# EAGLE schematic Solar_Tracker (EAGLE 7.5.0)

## Sheet 1 of 2
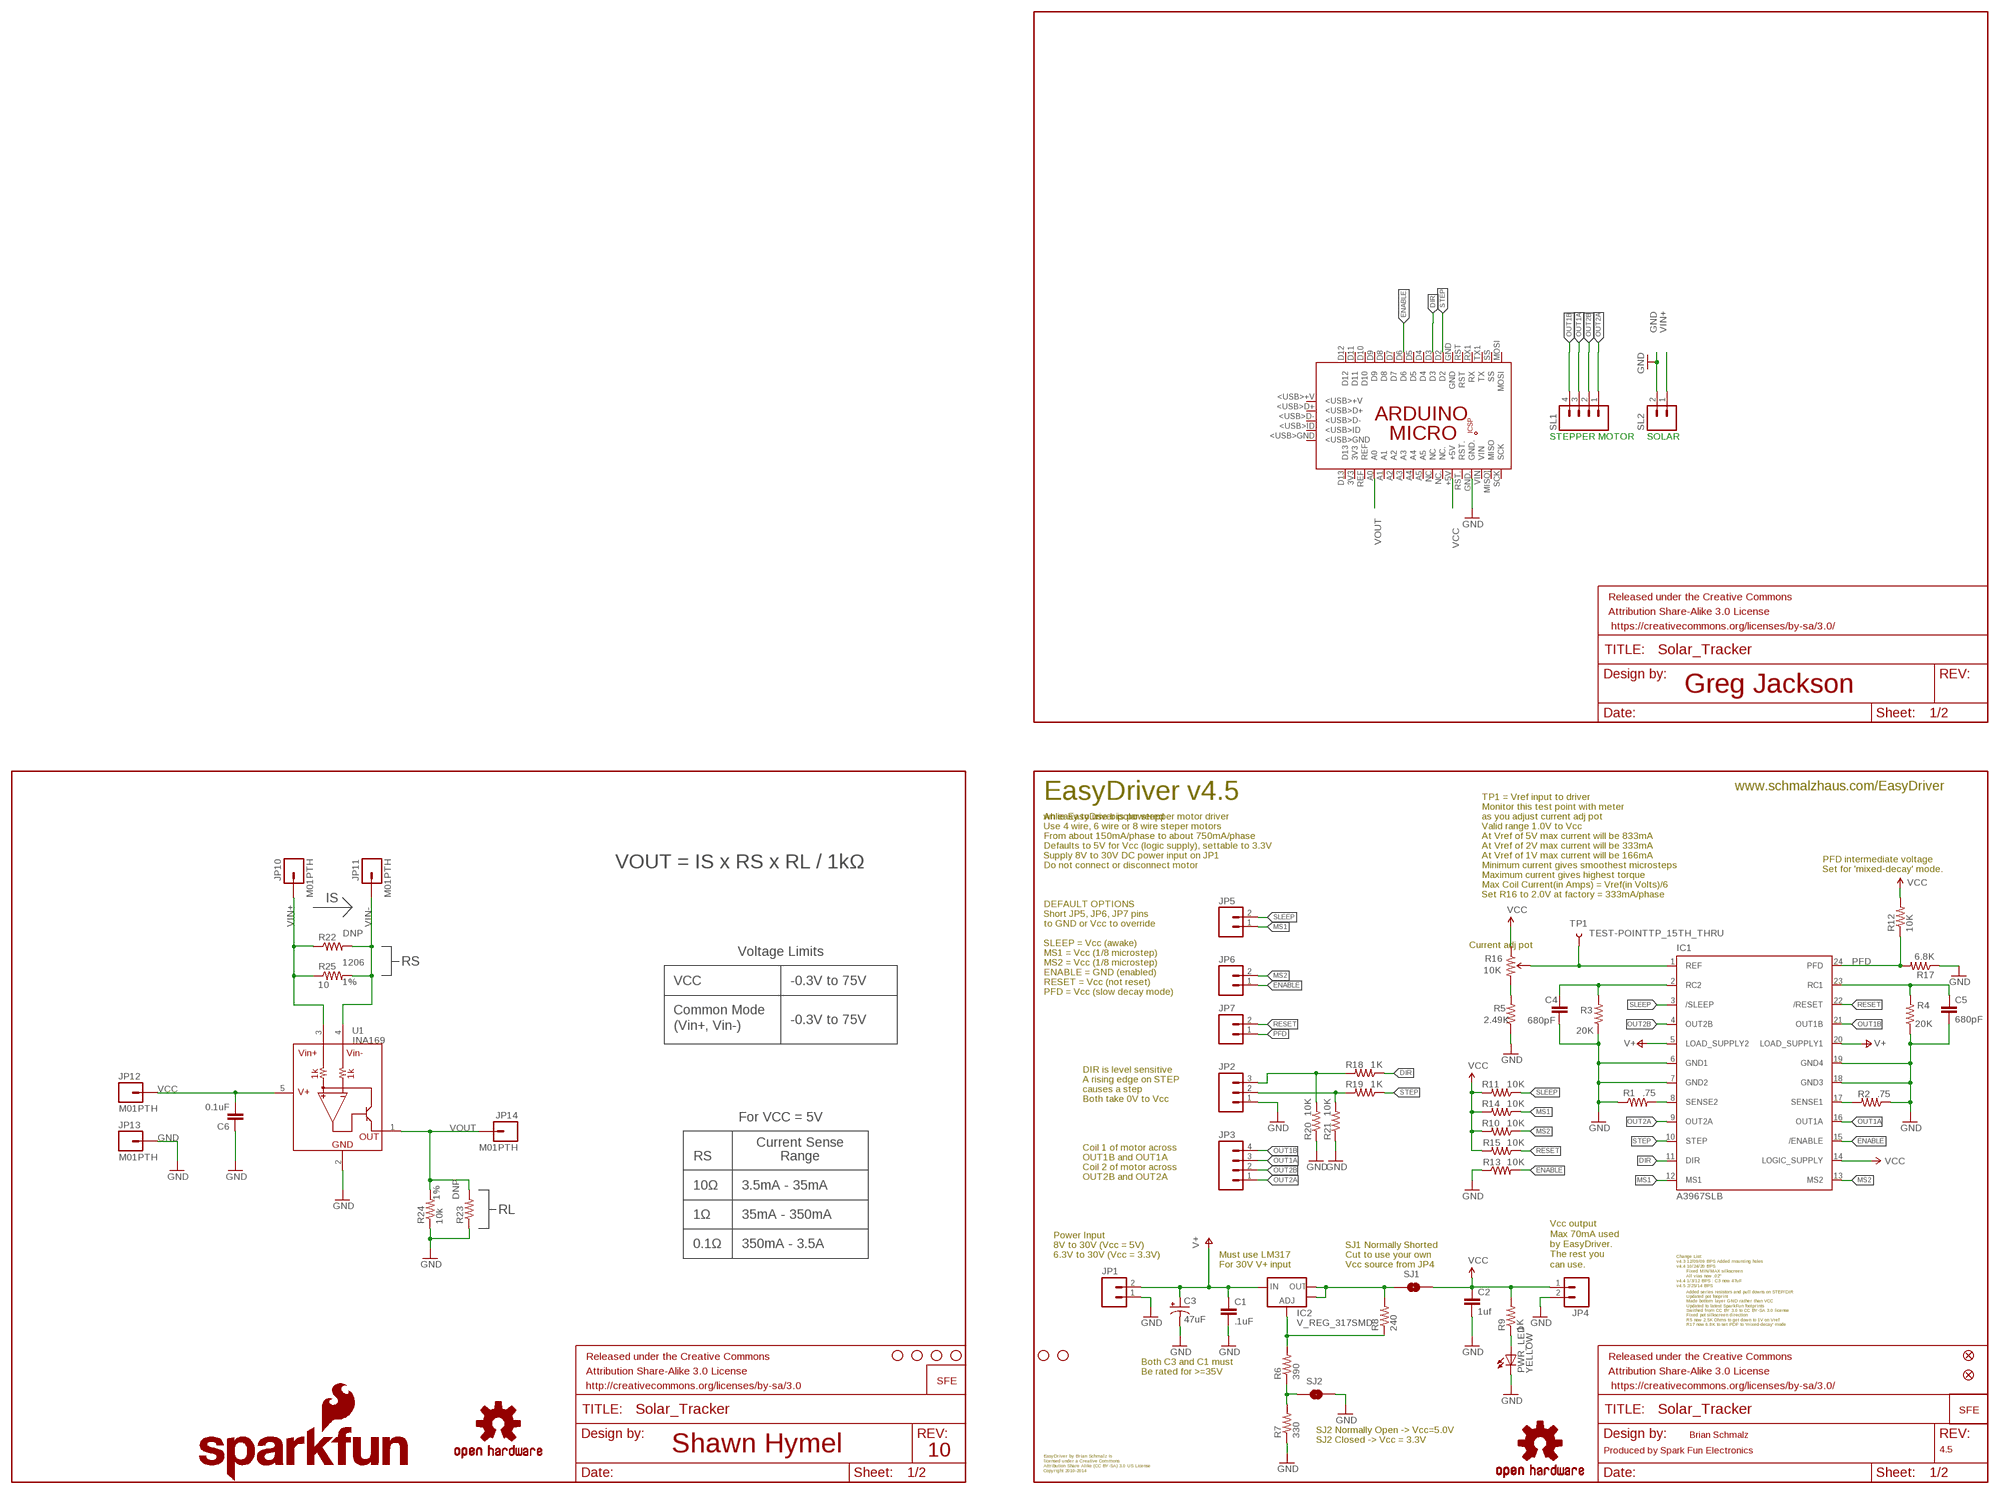
[diagram p0: schematic, sheet 1]

### Parts
C1  .1uF  CAP0603-CAP  [0603-CAP]
C2  1uf  CAP0603-CAP  [0603-CAP]
C3  47uF  CPOL-USD  [PANASONIC_D]
C4  680pF  CAP0603-CAP  [0603-CAP]
C5  680pF  CAP0603-CAP  [0603-CAP]
C6  0.1uF  CAP0603-CAP  [0603-CAP]
FID1  FIDUCIAL1X2  [FIDUCIAL-1X2]
FID2  FIDUCIAL1X2  [FIDUCIAL-1X2]
FRAME1  FRAME-LETTER  [CREATIVE_COMMONS]
FRAME2  FRAME-LETTER  [CREATIVE_COMMONS]
FRAME3  FRAME-LETTER  [CREATIVE_COMMONS]
IC1  A3967SLB  [SO24W]
IC2  V_REG_317SMD  [SOT223]
JP1  M021X02_NO_SILK  [1X02_NO_SILK]
JP2  M031X03_NO_SILK  [1X03_NO_SILK]
JP3  M041X04_NO_SILK  [1X04_NO_SILK]
JP4  M021X02_NO_SILK  [1X02_NO_SILK]
JP5  M021X02_NO_SILK  [1X02_NO_SILK]
JP6  M021X02_NO_SILK  [1X02_NO_SILK]
JP7  M021X02_NO_SILK  [1X02_NO_SILK]
JP8  STAND-OFF  [STAND-OFF]
JP9  STAND-OFF  [STAND-OFF]
JP10  M01PTH  [1X01]
JP11  M01PTH  [1X01]
JP12  M01PTH  [1X01]
JP13  M01PTH  [1X01]
JP14  M01PTH  [1X01]
LOGO1  OSHW-LOGOS  [OSHW-LOGO-S]
LOGO2  SFE_LOGO_NAME_FLAME.1_INCH  [SFE_LOGO_NAME_FLAME_.1]
LOGO3  OSHW-LOGOS  [OSHW-LOGO-S]
LOGO4  LOGO-SFESK  [SFE-LOGO-FLAME]
PCB1  ARDUINO_MICRO  [ARDUINO_MICRO]
PWR_LED  YELLOW  LED-YELLOW0603  [LED-0603]
R1  .75  RESISTOR0805-RES  [0805]
R2  .75  RESISTOR0805-RES  [0805]
R3  20K  RESISTOR0603  [0603-RES]
R4  20K  RESISTOR0603  [0603-RES]
R5  2.49K  RESISTOR0603  [0603-RES]
R6  390  RESISTOR0603  [0603-RES]
R7  330  RESISTOR0603  [0603-RES]
R8  240  RESISTOR0603  [0603-RES]
R9  1K  RESISTOR0603  [0603-RES]
R10  10K  RESISTOR0603  [0603-RES]
R11  10K  RESISTOR0603  [0603-RES]
R12  10K  RESISTOR0603  [0603-RES]
R13  10K  RESISTOR0603  [0603-RES]
R14  10K  RESISTOR0603  [0603-RES]
R15  10K  RESISTOR0603  [0603-RES]
R16  10K  TRIMPOT3MM-2  [TRIMPOT-3MM-2]
R17  6.8K  RESISTOR0603  [0603-RES]
R18  1K  RESISTOR0603  [0603-RES]
R19  1K  RESISTOR0603  [0603-RES]
R20  10K  RESISTOR0603  [0603-RES]
R21  10K  RESISTOR0603  [0603-RES]
R22  RESISTORPTH-2W  [AXIAL-0.8]
R23  RESISTORPTH-1/4W  [AXIAL-0.4]
R24  10k  RESISTOR0603  [0603-RES]
R25  10  RESISTOR1206  [1206]
SJ1  SOLDERJUMPERTRACE  [SJ_2S-TRACE]
SJ2  SOLDERJUMPERNO  [SJ_2S-NO]
SL1  M04  [04P]
SL2  M02  [02P]
STANDOFF1  STAND-OFF  [STAND-OFF]
STANDOFF2  STAND-OFF  [STAND-OFF]
STANDOFF3  STAND-OFF  [STAND-OFF]
STANDOFF4  STAND-OFF  [STAND-OFF]
TP1  TEST-POINTTP_15TH_THRU  [TP_15TH]
U1  INA169  [SOT23-5]
U$2  LOGO-SFENEW  [SFE-NEW-WEBLOGO]

### Nets
5V_ALT: IC2.2(OUT) IC2.4(OUT) R8.2 SJ1.1
DIR: IC1.11(DIR) R18.1
DIR_IN: JP2.3 R18.2 R20.2
ENABLE: IC1.15(/ENABLE) JP6.1 R13.2
GND: C1.2 C2.2 C3.- C4.2 C5.2 C6.1 IC1.6(GND1) IC1.7(GND2) IC1.18(GND3) IC1.19(GND4) JP1.1 JP2.1 JP4.2 JP13.1 PCB1.GND. PWR_LED.C R1.1 R2.1 R3.1 R4.1 R5.1 R7.1 R13.1 R17.1 R20.1 R21.1 R23.P$1 R24.1 SJ2.2 SL2.2 U1.2(GND)
MS1: IC1.12(MS1) JP5.1 R14.1
MS2: IC1.13(MS2) JP6.2 R10.1
N$1: IC1.8(SENSE2) R1.2
N$2: PWR_LED.A R9.1
N$3: IC1.17(SENSE1) R2.2
N$4: R6.1 R7.2 SJ2.1
N$5: C4.1 IC1.2(RC2) R3.2
N$6: IC2.1(ADJ) R6.2 R8.1
N$7: C5.1 IC1.23(RC1) R4.2
N$11: R5.2 R16.3(CW)
N$12: PCB1.D6
N$13: SL1.4
N$14: SL1.3
N$15: SL1.2
N$16: SL1.1
N$19: PCB1.D2
N$20: PCB1.D3
OUT1A: IC1.16(OUT1A) JP3.3
OUT1B: IC1.21(OUT1B) JP3.4
OUT2A: IC1.9(OUT2A) JP3.1
OUT2B: IC1.4(OUT2B) JP3.2
PFD: IC1.24(PFD) JP7.1 R12.1 R17.2
RESET: IC1.22(/RESET) JP7.2 R15.1
SLEEP: IC1.3(/SLEEP) JP5.2 R11.1
STEP: IC1.10(STEP) R19.1
STEP_IN: JP2.2 R19.2 R21.2
V+: C1.1 C3.+ IC1.5(LOAD_SUPPLY2) IC1.20(LOAD_SUPPLY1) IC2.3(IN) JP1.2
VCC: C2.1 C6.2 IC1.14(LOGIC_SUPPLY) JP4.1 JP12.1 PCB1.+5V R9.2 R10.2 R11.2 R12.2 R14.2 R15.2 R16.1(CCW) SJ1.2 U1.5(V+)
VIN+: JP10.1 R22.P$1 R25.1 SL2.1 U1.3(VIN+)
VIN-: JP11.1 R22.P$2 R25.2 U1.4(VIN-)
VOUT: JP14.1 PCB1.A0 R23.P$2 R24.2 U1.1(OUT)
VREF: IC1.1(REF) R16.2(WIPER) TP1.P$1
Unconnected: PCB1.3V3 PCB1.5V PCB1.<USB>+V PCB1.<USB>D+ PCB1.<USB>D- PCB1.<USB>GND PCB1.<USB>ID PCB1.A1 PCB1.A2 PCB1.A3 PCB1.A4 PCB1.A5 PCB1.D4 PCB1.D5 PCB1.D7 PCB1.D8 PCB1.D9 PCB1.D10 PCB1.D11 PCB1.D12 PCB1.D13 PCB1.GND PCB1.GND_ PCB1.MISO. PCB1.MISO](MISO) PCB1.MOSI PCB1.MOSI. PCB1.NC PCB1.NC. PCB1.REF PCB1.RESET.. PCB1.RST PCB1.RST. PCB1.RX1(RX) PCB1.SCK PCB1.SCK. PCB1.SS PCB1.TX1(TX) PCB1.VIN

### Notes on the sheet
- STEPPER MOTOR | SOLAR
- Greg Jackson
- www.schmalzhaus.com/EasyDriver
- EasyDriver v4.5 | TP1 = Vref input to driver
- Monitor this test point with meter
- An easy to use bipolar stepper motor driver | whlie EasyDriver is powered | as you adjust current adj pot
- Use 4 wire, 6 wire or 8 wire steper motors | Valid range 1.0V to Vcc
- From about 150mA/phase to about 750mA/phase | At Vref of 5V max current will be 833mA
- Defaults to 5V for Vcc (logic supply), settable to 3.3V | At Vref of 2V max current will be 333mA
- Supply 8V to 30V DC power input on JP1 | At Vref of 1V max current will be 166mA
- PFD intermediate voltage
- VOUT = IS x RS x RL / 1kΩ | Do not connect or disconnect motor | Minimum current gives smoothest microsteps
- Set for 'mixed-decay' mode.
- Maximum current gives highest torque
- Max Coil Current(in Amps) = Vref(in Volts)/6
- Set R16 to 2.0V at factory = 333mA/phase
- IS
- DEFAULT OPTIONS
- Short JP5, JP6, JP7 pins
- to GND or Vcc to override
- SLEEP = Vcc (awake) | Current adj pot
- Voltage Limits | MS1 = Vcc (1/8 microstep)
- RS | MS2 = Vcc (1/8 microstep)
- ENABLE = GND (enabled)
- VCC | -0.3V to 75V | RESET = Vcc (not reset)
- PFD = Vcc (slow decay mode)
- Common Mode
- -0.3V to 75V
- (Vin+, Vin-)
- DIR is level sensitive
- A rising edge on STEP
- causes a step
- Both take 0V to Vcc
- For VCC = 5V
- Current Sense
- Coil 1 of motor across
- RS | Range | OUT1B and OUT1A
- Coil 2 of motor across
- OUT2B and OUT2A
- 10Ω | 3.5mA - 35mA
- RL
- 1Ω | 35mA - 350mA
- Power Input
- 0.1Ω | 350mA - 3.5A | 8V to 30V (Vcc = 5V) | SJ1 Normally Shorted
- 6.3V to 30V (Vcc = 3.3V) | Must use LM317 | Cut to use your own | Change List:
- v4.3 12/09/09 BPS Added mounting holes
- For 30V V+ input | Vcc source from JP4
- Vcc output
  Max 70mA used 
  by EasyDriver.
  The rest you 
  can use.
- v4.4 10/24/20 BPS
- Fixed MIN/MAX silkscreen
- All vias now .02"
- v4.4 1/3/12 BPS : C3 now 47uF
- v4.5 2/25/14 BPS
- Added series resistors and pull downs on STEP/DIR
  Updated pot fooprint
  Made bottom layer GND rather than VCC
  Updated to latest SparkFun footprints
  Swithed from CC BY 3.0 to CC BY-SA 3.0 license
  Fixed pot silkscreen direction
  R5 now 2.5K Ohms to get down to 1V on Vref
  R17 now 6.8K to set PDF to 'mixed-decay' mode
- Both C3 and C1 must
- Be rated for >=35V
- SJ2 Normally Open -> Vcc=5.0V
- Brian Schmalz
- SJ2 Closed -> Vcc = 3.3V
- Shawn Hymel | 10 | Produced by Spark Fun Electronics | 4.5
- EasyDriver by Brian Schmalz is
- licensed under a Creative Commons
- Attribution Share Alike (CC BY-SA) 3.0 US License
- Copyright 2010-2014

## Sheet 2 of 2

## Library data of the parts
C1 C2 C4 C5 = SparkFun-Capacitors:CAP: Capacitor Standard 0603 ceramic capacitor, and 0.1" leaded capacitor.
C3 = rcl:CPOL-US: POLARIZED CAPACITOR, American symbol
C6 = SparkFun-Passives:CAP: Capacitor Standard 0603 ceramic capacitor, and 0.1" leaded capacitor.
FID1 FID2 = SparkFun-Aesthetics:FIDUCIAL: Fiducial Alignment Points Various fiducial points for machine vision alignment.
FRAME1 = SparkFun-Aesthetics:FRAME-LETTER: Schematic Frame Standard 8.5x11 US Letter frame
FRAME2 FRAME3 = SparkFun-Retired:FRAME-LETTER: Schematic Frame Standard 8.5x11 US Letter frame
IC1 = Allegro:A3967SLB: ANALOG DEVICES
IC2 = SparkFun03_30_09:V_REG_317: Voltage Regulator Standard LM317 adjustable voltage regulator. AOI (Adjust Output Input). Google 'LM317 Calculator' for easy to use app to get the two resistor values needed. 240/720 for 5V output. 240/390 for 3.3V output. Spark Fun Electronics SKU : COM-00527
JP1 JP4-JP7 = SparkFun:M02: Header 2 Standard 2-pin 0.1" header. Use with straight break away headers (SKU : PRT-00116), right angle break away headers (PRT-00553), swiss pins (PRT-00743), machine pins (PRT-00117), and female headers (PRT-00115). Molex polarized connector foot print use with SKU : PRT-08233 with associated crimp pins and housings.
JP2 = SparkFun:M03: Header 3 Standard 3-pin 0.1" header. Use with straight break away headers (SKU : PRT-00116), right angle break away headers (PRT-00553), swiss pins (PRT-00743), machine pins (PRT-00117), and female headers (PRT-00115). Molex polarized connector foot print use with SKU : PRT-08232 with associated crimp pins and housings.
JP3 = SparkFun:M04: Header 4 Standard 4-pin 0.1" header. Use with straight break away headers (SKU : PRT-00116), right angle break away headers (PRT-00553), swiss pins (PRT-00743), machine pins (PRT-00117), and female headers (PRT-00115). Molex polarized connector foot print use with SKU : PRT-08231 with associated crimp pins and housings.
JP8 JP9 = SparkFun-7-28-09:STAND-OFF: Stand Off This is the mechanical footprint for a #4 phillips button head screw. Use the keepout ring to avoid running the screw head into surrounding components. SKU : PRT-00447
JP10-JP14 = SparkFun-Connectors:M01: Header 1 Standard 1-pin 0.1" header. Use with straight break away headers (SKU : PRT-00116), right angle break away headers (PRT-00553), swiss pins (PRT-00743), machine pins (PRT-00117), and female headers (PRT-00115).
LOGO1 LOGO3 = SparkFun-Aesthetics:OSHW-LOGO: Open Source Hardware Logo This logo indicates the piece of hardware it is found on incorporates a OSHW license and/or adheres to the definition of open source hardware found here: http://freedomdefined.org/OSHW
LOGO2 = SparkFun-Aesthetics:SFE_LOGO_NAME_FLAME: SFE Logo, name and flame This is the SparkFun full logo. The logo on the schematic will always be the same size; the package variant is the height of the flame part of the logo. Default layer for the logo on the board is tSilk.
LOGO4 = SparkFun-Aesthetics:LOGO-SFE: Spark Fun Electronics PCB Logo This is the standard Spark Fun Electronics PCB logo.
PCB1 = E14_Arduino_revB:ARDUINO_MICRO: Device for representing an Arduino Micro board with a footprint in an EAGLE design. Created by Dave Young for Element14. More EAGLE documentation at: http://www.element14.com/community/community/knode/cadsoft_eagle
PWR_LED = SparkFun-LED:LED-YELLOW: Yellow SMD LEDs LilyPad 1206- DIO-09909 0603- DIO-09003; PROD_ID: DIO-09003
R1-R15 R17-R21 = SparkFun-Resistors:RESISTOR: Resistor Basic schematic elements and footprints for 0603, 1206, and PTH resistors.
R16 = SparkFun-Electromechanical:TRIMPOT: Various small potentiometers for "set-and-forget" applications
R22 R23 = SparkFun-Resistors:RESISTOR: Resistor Basic schematic elements and footprints for 0603, 1206, and PTH resistors.; PLACE: DNP
R24 = SparkFun-Resistors:RESISTOR: Resistor Basic schematic elements and footprints for 0603, 1206, and PTH resistors.; TOL: 1%
R25 = SparkFun-Resistors:RESISTOR: Resistor Basic schematic elements and footprints for 0603, 1206, and PTH resistors.; SIZE: 1206; TOL: 1%
SJ1 SJ2 = SparkFun03_30_09:SOLDERJUMPER: Solder Jumper Standard SMD solder jumper. Used to automate production. Two varients : Normally Open and Normally Closed are the same, but have different paste layers. NC will have a large amount of paste and should jumper during reflow.
SL1 = con-amp-quick:M04: AMP QUICK CONNECTOR; OC_FARNELL: unknown; OC_NEWARK: unknown
SL2 = con-amp-quick:M02: AMP QUICK CONNECTOR; OC_FARNELL: unknown; OC_NEWARK: unknown
STANDOFF1-STANDOFF4 = SparkFun-Electromechanical:STAND-OFF: #4 Stand Off This is the mechanical footprint for a #4 phillips button head screw. Use the keepout ring to avoid running the screw head into surrounding components. SKU : PRT-00447
TP1 = SparkFun-Passives:TEST-POINT: Bare copper test points for troubleshooting or ICT
U1 = SparkFun-AnalogIC:INA169
U$2 = SparkFun:LOGO-SFE: Spark Fun Electronics PCB Logo This is the standard Spark Fun Electronics PCB logo.